# Altium schematic sheet OLD_eps_bb1.SchDoc
size A4; SheetNumber: 7; SheetTotal: 19
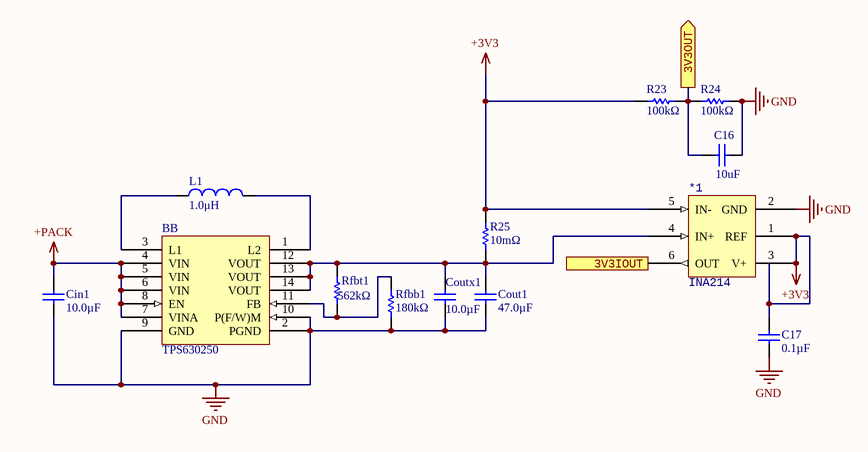
[diagram p0: OLD_eps_bb1.SchDoc]

## Parts
*1  INA214  [SOT65P210X110-6N]
BB  TPS630250  [RNC0014A]
C16  10uF  [1608[0603]]
C17  0.1µF  [1608[0603]]
Cin1  10.0µF  [1608[0603]]
Cout1  47.0µF  [1608[0603]]
Coutx1  10.0µF  [1608[0603]]
L1  1.0μH  [1608[0603]]
R23  100kΩ  [1608[0603]]
R24  100kΩ  [1608[0603]]
R25  10mΩ  [1608[0603]]
Rfbb1  180kΩ  [1608[0603]]
Rfbt1  562kΩ  [1608[0603]]

## Ports
3V3IOUT (out), 3V3OUT (out)

## Nets
+3V3: *1.1(REF) *1.3(V+) *1.5(IN-) C17.2 R23.1 R25.2
+PACK: BB.4(VIN) BB.5(VIN) BB.6(VIN) BB.7(VINA) BB.8(EN) Cin1.2
GND: *1.2(GND) BB.2(PGND) BB.9(GND) BB.10(P(F/W)M) C16.1 C17.1 Cin1.1 Cout1.1 Coutx1.1 R24.2 Rfbb1.1
3V3IOUT: *1.6(OUT) ; port 3V3IOUT
3V3OUT: C16.2 R23.2 R24.1 ; port 3V3OUT
Net*1_4: *1.4(IN+) BB.12(VOUT) BB.13(VOUT) BB.14(VOUT) Cout1.2 Coutx1.2 R25.1 Rfbt1.1
NetBB_1: BB.1(L2) L1.2
NetBB_3: BB.3(L1) L1.1
NetBB_11: BB.11(FB) Rfbb1.2 Rfbt1.2

## Library data of the parts
*1 = INA214: Current monitor
BB = TPS630250: Buck-boost converter; Supplier 1: Digi-Key; Supplier Part Number 1: 296-42036-6-ND
C16 Cin1 Cout1 Coutx1 = Cap: Capacitor; Published: 8-Jun-2000; LatestRevisionDate: 17-Jul-2002; LatestRevisionNote: Re-released for DXP Platform.; PackageReference: RAD-0.3; Publisher: Altium Limited; PackageDescription: Radial Cap, Thru-Hole; 2 Leads; 0.3 in Pin Spacing
  C16: Value: 10uF
  Cin1 Coutx1: Value: 10.0µF
  Cout1: Value: 47.0µF
C17 = Cap Semi: Capacitor (Semiconductor SIM Model); Published: 8-Jun-2000; LatestRevisionDate: 29-May-2009; LatestRevisionNote: IPC-7351 Footprint Added.; PackageReference: C1206; Publisher: Altium Limited; PackageDescription: Chip Capacitor; Value: 0.1µF
L1 = Inductor: Code_IEC: 1005; Published: 8-Jun-2000; LatestRevisionDate: 29-May-2009; LatestRevisionNote: IPC-7351 Footprint Added.; PackageReference: 0402-A; Publisher: Altium Limited; PackageDescription: Chip Inductor; Code_JEITA: 0402; Value: 1.0μH
R23-R25 Rfbb1 Rfbt1 = Res1: Resistor; Published: 8-Jun-2000; LatestRevisionDate: 17-Jul-2002; LatestRevisionNote: Re-released for DXP Platform.; PackageReference: AXIAL-0.3; Publisher: Altium Limited; PackageDescription: Axial Device, Thru-Hole; 2 Leads; 0.3 in Pin Spacing
  R23 R24: Value: 100kΩ
  R25: Value: 10mΩ
  Rfbb1: Value: 180kΩ
  Rfbt1: Value: 562kΩ